# EAGLE design XStick._XS1-L4 (EAGLE 7.1.0)
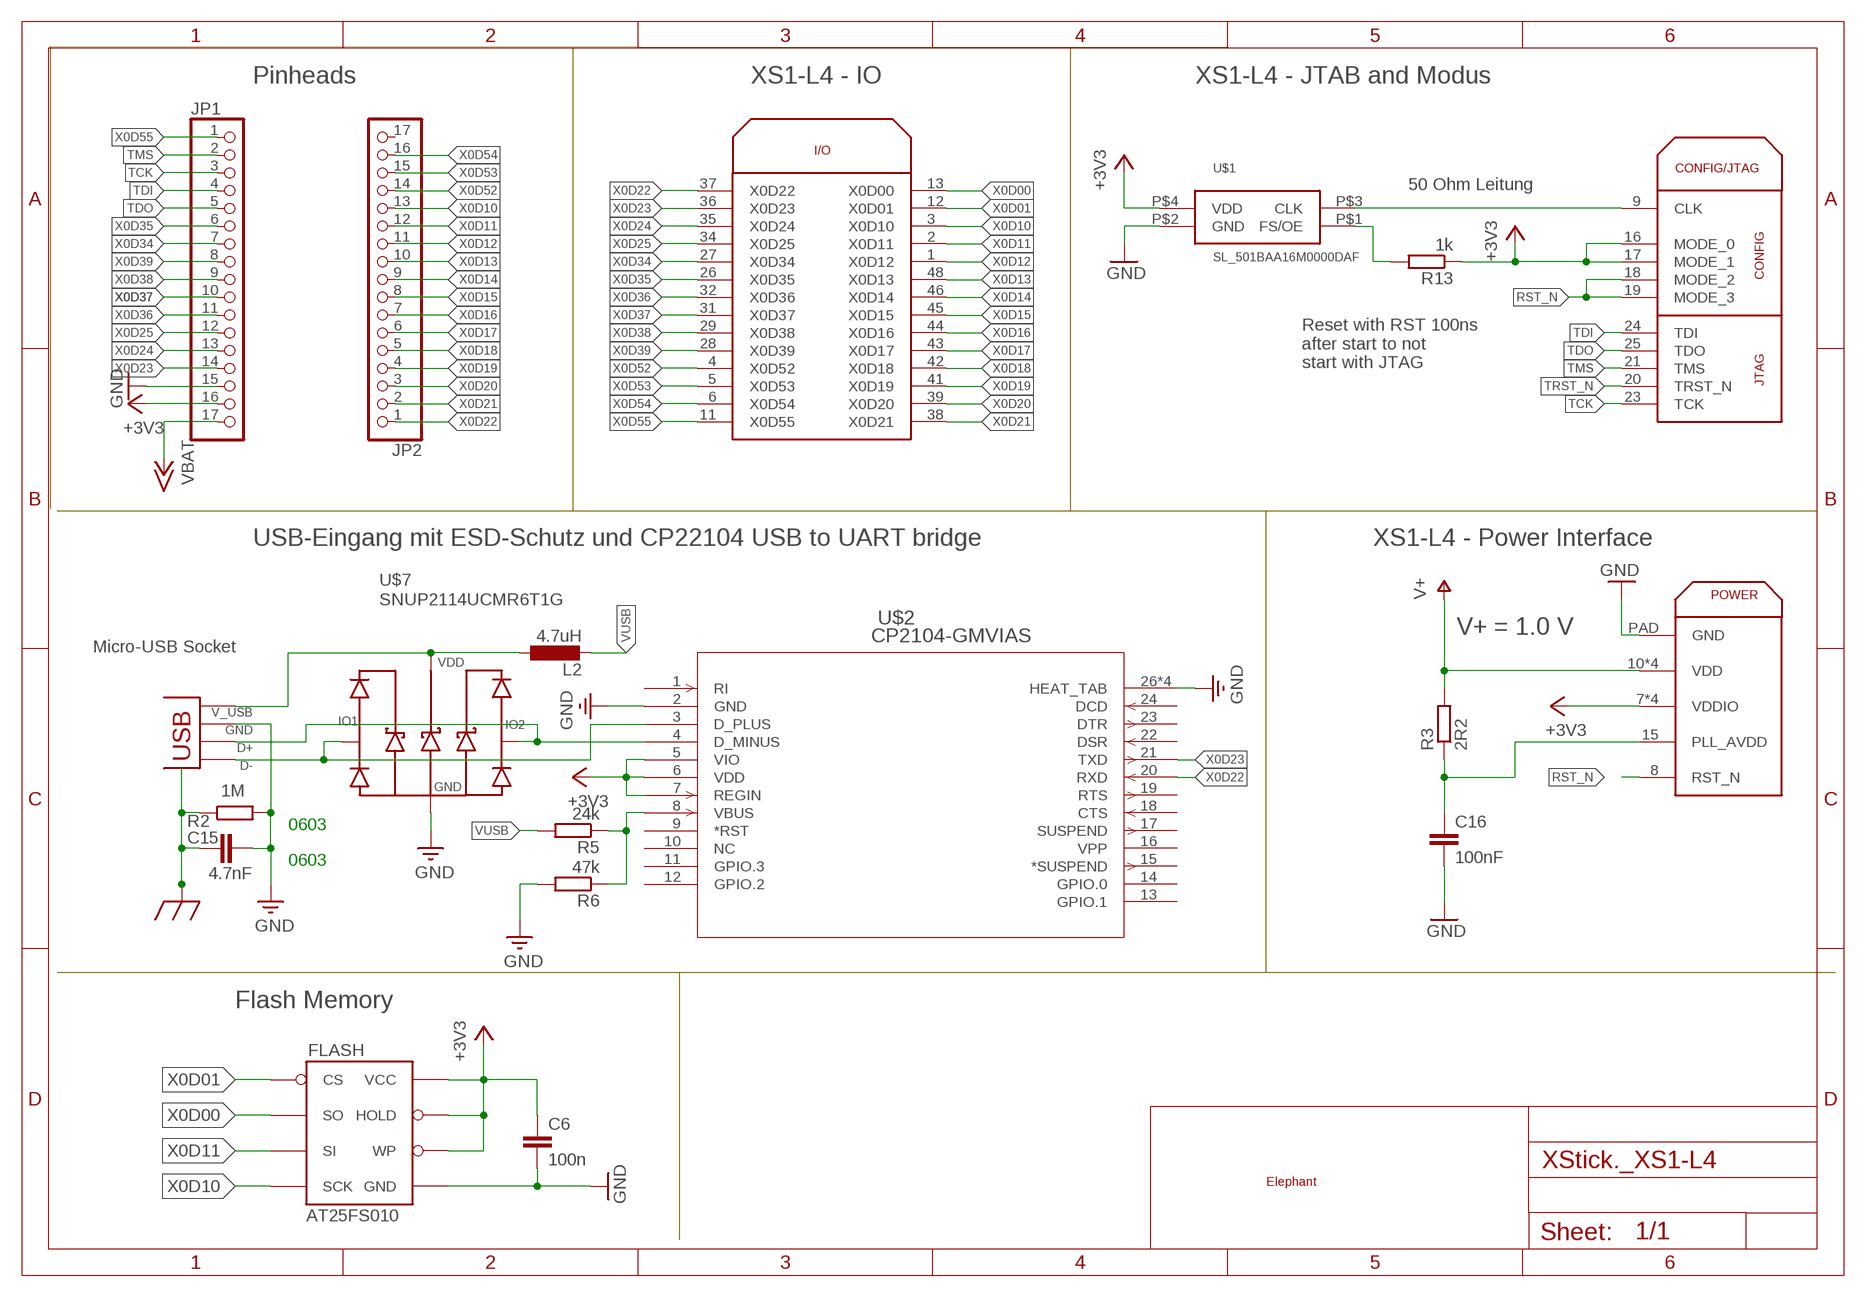
[diagram p0: schematic, sheet 1, part 1 of 2]
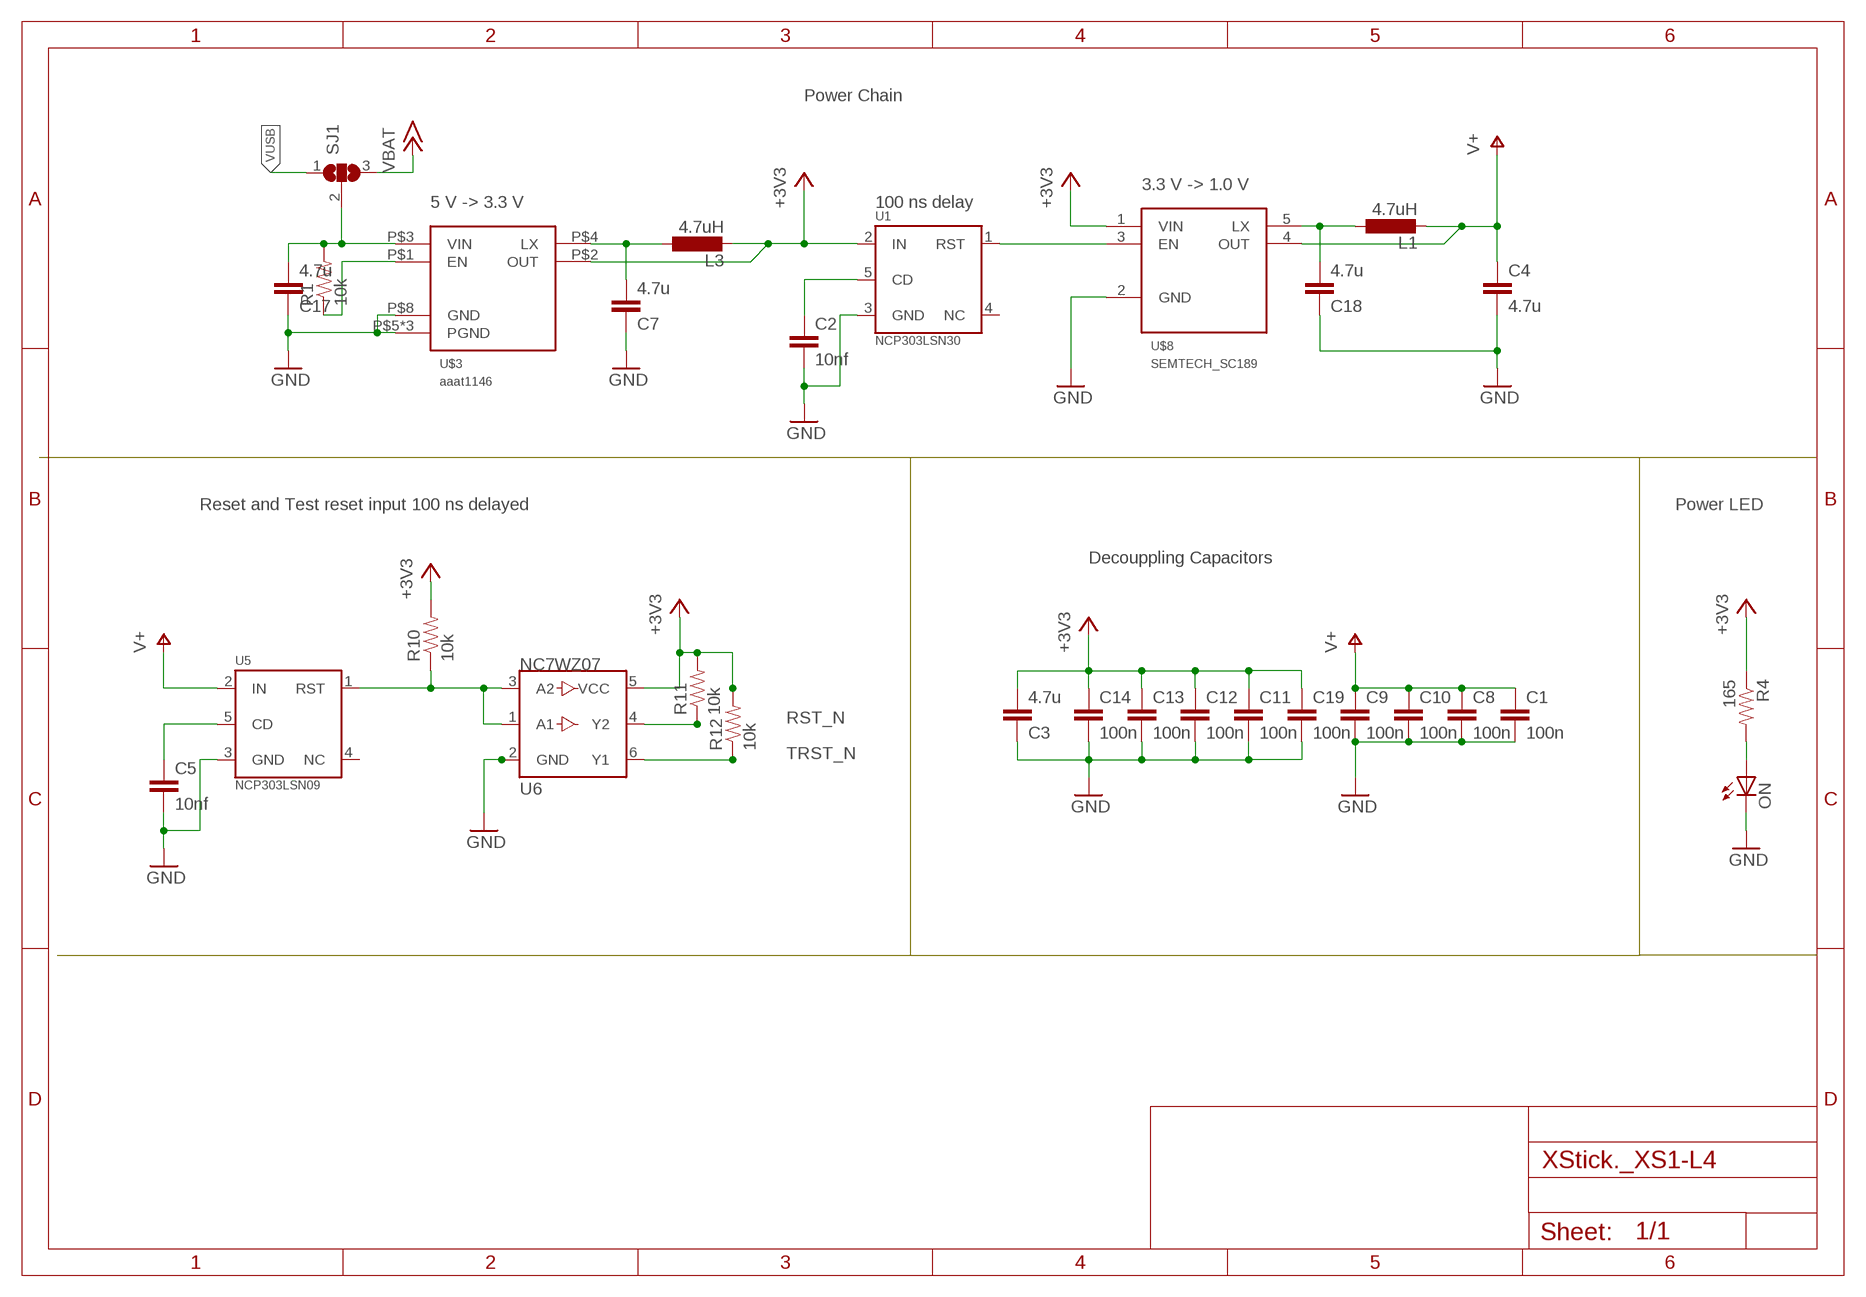
[diagram p1: schematic, sheet 1, part 2 of 2]

## Parts
C1  100n  C-EUC0402  [C0402]
C2  10nf  CAP0603-CAP  [0603-CAP]
C3  4.7u  CAP0603-CAP  [0603-CAP]
C4  4.7u  CAP0603-CAP  [0603-CAP]
C5  10nf  CAP0603-CAP  [0603-CAP]
C6  100n  C-EUC0402  [C0402]
C7  4.7u  CAP0603-CAP  [0603-CAP]
C8  100n  C-EUC0402  [C0402]
C9  100n  C-EUC0402  [C0402]
C10  100n  C-EUC0402  [C0402]
C11  100n  C-EUC0402  [C0402]
C12  100n  C-EUC0402  [C0402]
C13  100n  C-EUC0402  [C0402]
C14  100n  C-EUC0402  [C0402]
C15  4.7nF  C_EU0603MARK  [C0603M]
C16  100nF  C-EUC0402  [C0402]
C17  4.7u  CAP0603-CAP  [0603-CAP]
C18  4.7u  CAP0603-CAP  [0603-CAP]
C19  100n  C-EUC0402  [C0402]
FLASH  AT25FS010  [SO08WIDE]
JP1  PINHD-1X17  [1X17]
JP2  PINHD-1X17  [1X17]
L1  4.7uH  L-EUL0603  [C0603]
L2  4.7uH  L-EUL0603  [C0603]
L3  4.7uH  L-EUL0603  [C0603]
ON  LED0603  [LED-0603]
R1  10k  RESISTOR0603-RES  [0603-RES]
R2  1M  RESISTOR0603MARK  [R0603M]
R3  2R2  R-EU_R0603  [R0603]
R4  165  RESISTOR0603-RES  [0603-RES]
R5  24k  R-EU_R0603  [R0603]
R6  47k  R-EU_R0603  [R0603]
R10  10k  RESISTOR0603-RES  [0603-RES]
R11  10k  RESISTOR0603-RES  [0603-RES]
R12  10k  RESISTOR0603-RES  [0603-RES]
R13  1k  R-EU_R0603  [R0603]
SJ1  SJ2W  [SJ_2]
U1  NCP303LSN30  NCP303LSN09  [SOT23-5]
U5  NCP303LSN09  [SOT23-5]
U6  NC7WZ07  [SC70-6]
U$1  SL_501BAA16M0000DAF  [SL_OSZ]
U$2  CP2104-GMVIAS  [QFN24_4X4_VIAS]
U$3  aaat1146  SKYWORKS_AAT1146_SC70JW-8  [SC70JW-8]
U$4  ELEPHANT  [ELEPHANT]
U$5  XS1-L01A-TQ48  [TQFP48]
U$7  SNUP2114UCMR6T1G  [TSOP-6]
U$8  SEMTECH_SC189  [SOT23-5]
USB_SKT  USB_SHIELD_8  [USB_MICRO_B]

## Nets
+3V3 [Power]: C3.2 C6.1 C11.1 C12.1 C13.1 C14.1 C19.1 FLASH.3(WP) FLASH.7(HOLD) FLASH.8(VCC) JP1.16 L3.2 R4.1 R10.2 R11.2 R12.2 R13.1 U1.2(IN) U6.5(VCC) U$1.P$4(VDD) U$2.5(VIO) U$2.6(VDD) U$2.7(REGIN) U$3.P$2(OUT) U$5.7(VDDIO) U$5.14(VDDIO) U$5.16(MODE_0) U$5.17(MODE_1) U$5.30(VDDIO) U$5.40(VDDIO) U$8.1(VIN)
+15V: JP1.17 SJ1.3 ; supply symbol labelled VBAT
D+: U$2.4(D_MINUS) U$7.1(I/O1) USB_SKT.D+
D-: U$2.3(D_PLUS) U$7.6(I/O2) USB_SKT.D-
GND: C1.2 C2.2 C3.1 C4.2 C5.2 C6.2 C7.1 C8.2 C9.2 C10.2 C11.2 C12.2 C13.2 C14.2 C15.1 C16.2 C17.1 C18.1 C19.2 FLASH.4(GND) JP1.15 ON.C R2.2 R6.2 U1.3(GND) U5.3(GND) U6.2(GND) U$1.P$2(GND) U$2.2(GND) U$2.26(HEAT_TAB) U$2.27(HEAT_TAB) U$2.28(HEAT_TAB) U$2.29(HEAT_TAB) U$3.P$5(PGND) U$3.P$6(PGND) U$3.P$7(PGND) U$3.P$8(GND) U$5.PAD(GND) U$7.2(VN) U$8.2(GND) USB_SKT.GND
N$1: U$1.P$3(CLK) U$5.9(CLK)
N$3: C7.2 L3.1 U$3.P$4(LX)
N$4: R10.1 U5.1(RST) U6.1(A1) U6.3(A2)
N$5: ON.A R4.2
N$6: C5.1 U5.5(CD)
N$7: U1.1(RST) U$8.3(EN)
N$8: C18.2 L1.1 U$8.5(LX)
N$9: L2.1 U$7.5(VP) USB_SKT.VBUS(V_USB)
N$10: C2.1 U1.5(CD)
N$11: C17.2 R1.2 SJ1.2 U$3.P$3(VIN)
N$12 [Power]: R13.2 U$1.P$1(FS/OE)
N$14: R1.1 U$3.P$1(EN)
N$15: R5.1 R6.1 U$2.8(VBUS)
N$50: C16.1 R3.1 U$5.15(PLL_AVDD)
RST_N: R11.1 U6.4(Y2) U$5.8(RST_N) U$5.18(MODE_2) U$5.19(MODE_3)
TCK: JP1.3 U$5.23(TCK)
TDI: JP1.4 U$5.24(TDI)
TDO: JP1.5 U$5.25(TDO)
TMS: JP1.2 U$5.21(TMS)
TRST_N: R12.1 U6.6(Y1) U$5.20(TRST_N)
USB_SHIELD: C15.2 R2.1 USB_SKT.SHIELD$1 USB_SKT.SHIELD$2(SHIELD$1) USB_SKT.SHIELD$3(SHIELD$1) USB_SKT.SHIELD$4(SHIELD$1) USB_SKT.SHIELD$5(SHIELD$1) USB_SKT.SHIELD$6(SHIELD$1) USB_SKT.SHIELD$7(SHIELD$1) USB_SKT.SHIELD$8(SHIELD$1)
V+: C1.1 C4.1 C8.1 C9.1 C10.1 L1.2 R3.2 U5.2(IN) U$5.10(VDD) U$5.22(VDD) U$5.33(VDD) U$5.47(VDD) U$8.4(OUT)
VUSB: L2.2 R5.2 SJ1.1
X0D00 [Wire out]: FLASH.2(SO) U$5.13(X0D00)
X0D01 [Wire out]: FLASH.1(CS) U$5.12(X0D01)
X0D10: FLASH.6(SCK) JP2.13 U$5.3(X0D10)
X0D11: FLASH.5(SI) JP2.12 U$5.2(X0D11)
X0D12: JP2.11 U$5.1(X0D12)
X0D13: JP2.10 U$5.48(X0D13)
X0D14: JP2.9 U$5.46(X0D14)
X0D15: JP2.8 U$5.45(X0D15)
X0D16: JP2.7 U$5.44(X0D16)
X0D17: JP2.6 U$5.43(X0D17)
X0D18: JP2.5 U$5.42(X0D18)
X0D19: JP2.4 U$5.41(X0D19)
X0D20: JP2.3 U$5.39(X0D20)
X0D21: JP2.2 U$5.38(X0D21)
X0D22: JP2.1 U$2.20(RXD) U$5.37(X0D22)
X0D23: JP1.14 U$2.21(TXD) U$5.36(X0D23)
X0D24: JP1.13 U$5.35(X0D24)
X0D25: JP1.12 U$5.34(X0D25)
X0D34: JP1.7 U$5.27(X0D34)
X0D35: JP1.6 U$5.26(X0D35)
X0D36: JP1.11 U$5.32(X0D36)
X0D37: JP1.10 U$5.31(X0D37)
X0D38: JP1.9 U$5.29(X0D38)
X0D39: JP1.8 U$5.28(X0D39)
X0D52: JP2.14 U$5.4(X0D52)
X0D53: JP2.15 U$5.5(X0D53)
X0D54: JP2.16 U$5.6(X0D54)
X0D55: JP1.1 U$5.11(X0D55)
Unconnected: JP2.17 U1.4(NC) U5.4(NC) U$2.1(RI) U$2.9(*RST) U$2.10(NC) U$2.11(GPIO.3) U$2.12(GPIO.2) U$2.13(GPIO.1) U$2.14(GPIO.0) U$2.15(*SUSPEND) U$2.16(VPP) U$2.17(SUSPEND) U$2.18(CTS) U$2.19(RTS) U$2.22(DSR) U$2.23(DTR) U$2.24(DCD)

## Notes on the sheet
- Pinheads | XS1-L4 - IO | XS1-L4 - JTAB and Modus
- Power Chain
- 50 Ohm Leitung | 3.3 V -> 1.0 V
- 5 V -> 3.3 V | 100 ns delay
- Reset with RST 100ns 
  after start to not 
  start with JTAG
- Reset and Test reset input 100 ns delayed | Power LED
- USB-Eingang mit ESD-Schutz und CP22104 USB to UART bridge | XS1-L4 - Power Interface
- Decouppling Capacitors
- V+ = 1.0 V
- Micro-USB Socket
- 0603
- 0603
- Flash Memory

## Library data of the parts
C1 C6 C8-C14 C16 C19 = rcl:C-EU: CAPACITOR, European symbol
C2-C5 C7 C17 C18 = SparkFun:CAP: Capacitor Standard 0603 ceramic capacitor, and 0.1" leaded capacitor.
C15 = Batten:C_EU
FLASH = SparkFun:AT25FS010
JP1 JP2 = pinhead_original:PINHD-1X17: PIN HEADER
L1-L3 = rcl:L-EU: INDUCTOR, European symbol
ON = SparkFun:LED: LEDs Standard schematic elements and footprints for 5mm, 3mm, 1206, and 0603 sized LEDs. 5mm - Spark Fun Electronics SKU : COM-00529 (and others)
R1 R4 R10-R12 = SparkFun:RESISTOR: Resistor Basic schematic elements and footprints for 0603, 1206, and PTH 1/10th watt (small) resistors.
R2 = Batten:RESISTOR
R3 R5 R6 R13 = resistor:R-EU_: RESISTOR, European symbol
SJ1 = jumper:SJ2W: SMD solder JUMPER
U1 U5 = SparkFun:NCP303LSN09
U6 = SparkFun:NC7WZ07
U$1 = Carlos2014:SL_501BAA16M0000
U$2 = Carlos2014:CP2104-GM
U$3 = Carlos2014:SKYWORKS_AAT1146
U$4 = Carlos2014:ELEPHANT
U$5 = XMOS:XS1-L01A-TQ48
U$7 = Carlos2014:SNUP2114
U$8 = Carlos2014:SEMTECH_SC189
USB_SKT = Batten:USB_SHIELD_8

## Board
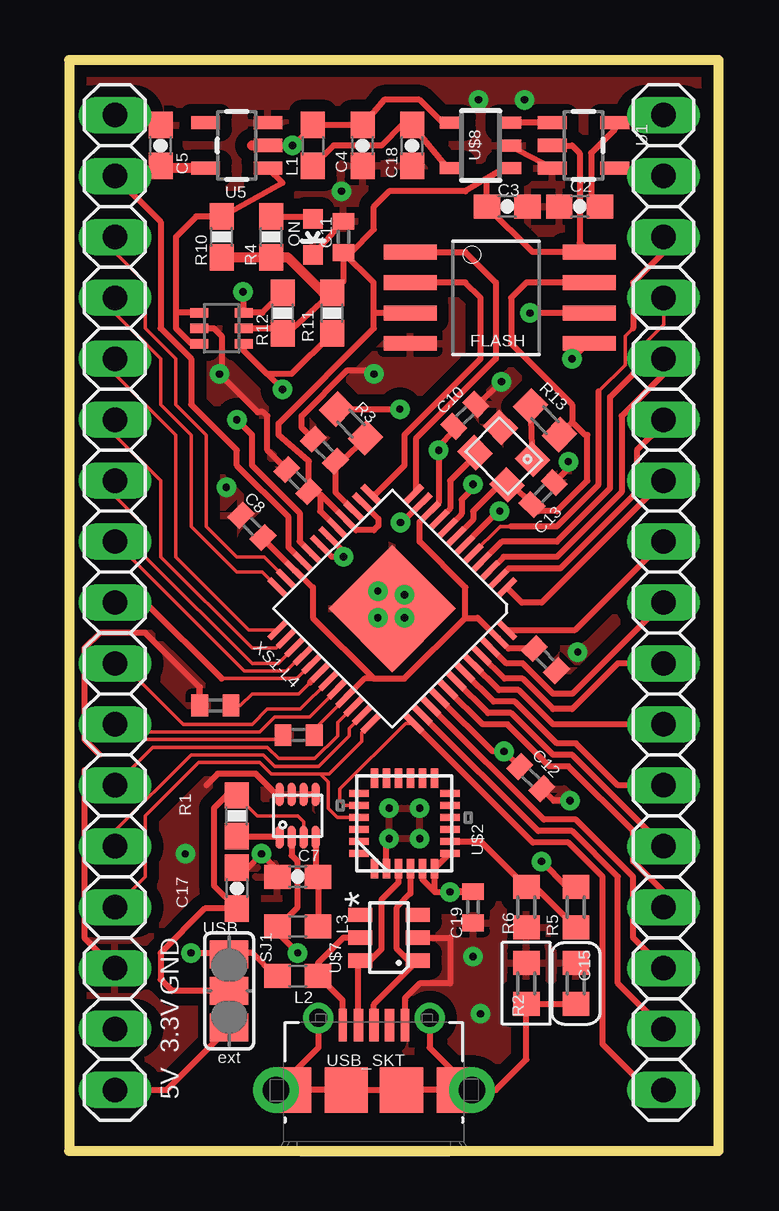
[diagram p2: board, top side]
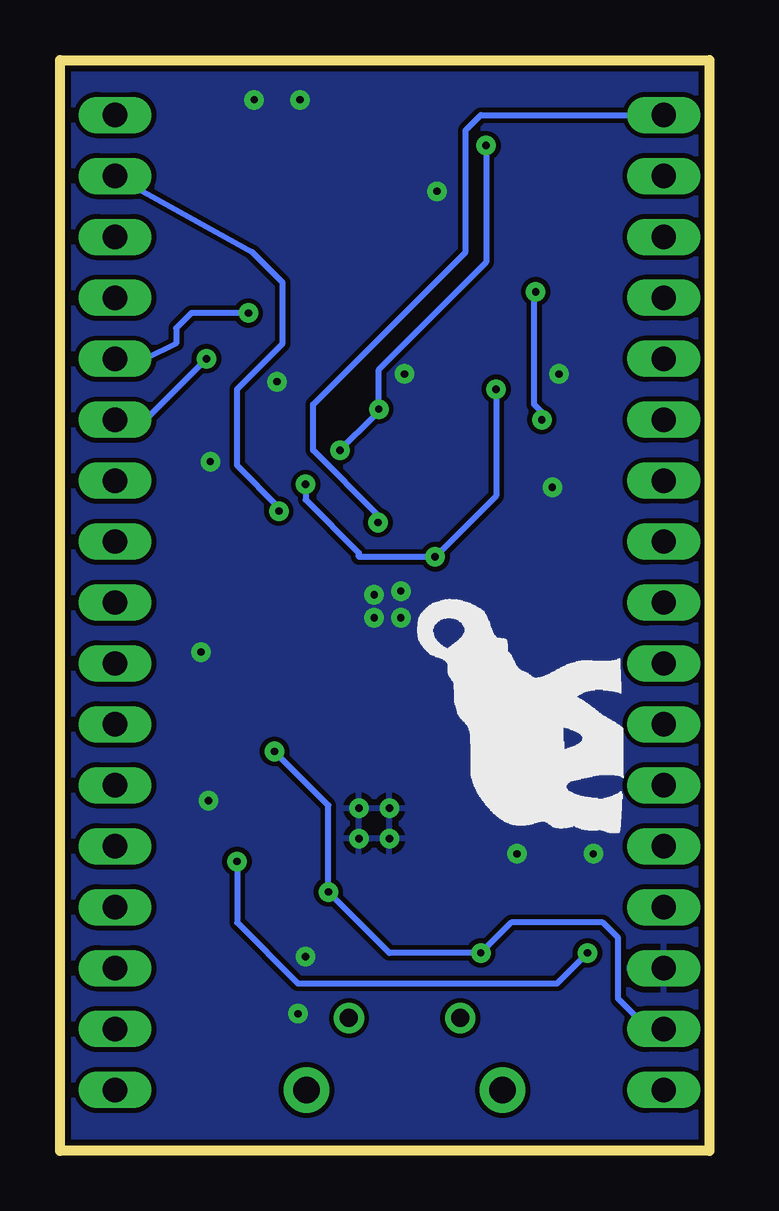
[diagram p3: board, bottom side, seen from below]

Size 27.06 x 45.48 mm. Coordinates in mm from the lower left corner, seen from the top.
Outline: 0,0 27.06,0 27.06,45.48 0,45.48 0,0
Copper layers (1*16): Top 0.035mm / dielectric 1.5mm / Bottom 0.035mm
Design rules "SeeedStudio_2layer_DRU_CM": minimum track width 6mil, minimum drill 12mil, track to track 6mil, track to pad 6mil, pad to pad 6mil, via to via 6mil, smd to smd 0mil, copper to edge 10mil, drill to drill 10mil, minimum pad ring 10mil, minimum via ring 6mil, stop-mask expansion 2mil, vias tented up to drill 100mil, thermal gap 10mil

### Footprints (pad centres in the part's own frame; a part is rotated, then mirrored left to right if it is on the bottom)
C0402 = smd 0.7 x 0.9: 1 -0.65,0; 2 0.65,0
0603-CAP = smd 1.1 x 1: 1 -0.85,0; 2 0.85,0
C0603M = smd 1 x 1.1: 1 -0.85,0; 2 0.85,0
SO08WIDE = smd 0.61 x 2.21: 1 -1.905,-3.569; 2 -0.635,-3.569; 3 0.635,-3.569; 4 1.905,-3.569; 5 1.905,3.886; 6 0.635,3.886; 7 -0.635,3.886; 8 -1.905,3.886
1X17 = drill 1.016 long: 1 -20.32,0; 2 -17.78,0; 3 -15.24,0; 4 -12.7,0; 5 -10.16,0; 6 -7.62,0; 7 -5.08,0; 8 -2.54,0; 9 0,0; 10 2.54,0; 11 5.08,0; 12 7.62,0; 13 10.16,0; 14 12.7,0; 15 15.24,0; 16 17.78,0; 17 20.32,0
C0603 = smd 1.1 x 1: 1 -0.85,0; 2 0.85,0
LED-0603 = smd 0.8 x 0.8: A 0,-0.75; C 0,0.75
0603-RES = smd 1.1 x 1: 1 -0.85,0; 2 0.85,0
R0603M = smd 1 x 1.1: 1 -0.85,0; 2 0.85,0
R0603 = smd 1 x 1.1: 1 -0.85,0; 2 0.85,0
SJ_2 = smd 1.168 x 1.6: 1 -1.524,0; 2 0,0; 3 1.524,0
SOT23-5 = smd 0.55 x 1.2: 1 -0.95,-1.3; 2 0,-1.3; 3 0.95,-1.3; 4 0.95,1.3; 5 -0.95,1.3
SC70-6 = smd 0.4 x 0.75: 1 -0.65,-0.925; 2 0,-0.925; 3 0.65,-0.925; 4 0.65,0.925; 5 0,0.925; 6 -0.65,0.925
SL_OSZ = smd 1.1 x 1: P$1 -0.95,-0.75; P$2 0.95,-0.75; P$3 0.95,0.75; P$4 -0.95,0.75
QFN24_4X4_VIAS = smd 0.813 x 0.305: 1 -1.892,1.25; 2 -1.892,0.75; 3 -1.892,0.25; 4 -1.892,-0.25; 5 -1.892,-0.75; 6 -1.892,-1.25; 13 1.892,-1.25; 14 1.892,-0.75; 15 1.892,-0.25; 16 1.892,0.25; 17 1.892,0.75; 18 1.892,1.25 | smd 0.305 x 0.813: 7 -1.25,-1.892; 8 -0.75,-1.892; 9 -0.25,-1.892; 10 0.25,-1.892; 11 0.75,-1.892; 12 1.25,-1.892; 19 1.25,1.892; 20 0.75,1.892; 21 0.25,1.892; 22 -0.25,1.892; 23 -0.75,1.892; 24 -1.25,1.892 | drill 0.305 pad 0.813: 26 -0.635,-0.635; 27 0.635,0.635; 28 -0.635,0.635; 29 0.635,-0.635
SC70JW-8 = smd 0.965 x 0.33: P$1 -0.889,0.75; P$2 -0.889,0.25; P$3 -0.889,-0.25; P$4 -0.889,-0.75; P$5 0.889,-0.75; P$6 0.889,-0.25; P$7 0.889,0.25; P$8 0.889,0.75
TQFP48 = smd 1 x 0.25: 1 -3.93,2.905; 2 -3.93,2.405; 3 -3.93,1.905; 4 -3.93,1.405; 5 -3.93,0.905; 6 -3.93,0.405; 7 -3.93,-0.095; 8 -3.93,-0.595; 9 -3.93,-1.095; 10 -3.93,-1.595; 11 -3.93,-2.095; 12 -3.93,-2.595; 25 4.07,-2.595; 26 4.07,-2.095; 27 4.07,-1.595; 28 4.07,-1.095; 29 4.07,-0.595; 30 4.07,-0.095; 31 4.07,0.405; 32 4.07,0.905; 33 4.07,1.405; 34 4.07,1.905; 35 4.07,2.405; 36 4.07,2.905 | smd 0.25 x 1: 13 -2.68,-3.845; 14 -2.18,-3.845; 15 -1.68,-3.845; 16 -1.18,-3.845; 17 -0.68,-3.845; 18 -0.18,-3.845; 19 0.32,-3.845; 20 0.82,-3.845; 21 1.32,-3.845; 22 1.82,-3.845; 23 2.32,-3.845; 24 2.82,-3.845; 37 2.82,4.155; 38 2.32,4.155; 39 1.82,4.155; 40 1.32,4.155; 41 0.82,4.155; 42 0.32,4.155; 43 -0.18,4.155; 44 -0.68,4.155; 45 -1.18,4.155; 46 -1.68,4.155; 47 -2.18,4.155; 48 -2.68,4.155 | smd 3.75 x 3.75: PAD 0.07,0.155
TSOP-6 = smd 0.6 x 1: 1 -0.95,-1.2; 2 0,-1.2; 3 0.95,-1.2; 4 0.95,1.2; 5 0,1.2; 6 -0.95,1.2
SOT23-5' = smd 0.5 x 1: 1 -0.95,-1.2; 2 0,-1.2; 3 0.95,-1.2; 4 0.95,1.2; 5 -0.95,1.2
USB_MICRO_B = smd 0.4 x 1.35: D+ 0,-2.7; D- 0.65,-2.7; ID -0.65,-2.7 | smd 0.35 x 1.35: GND -1.3,-2.7; VBUS 1.3,-2.7 | drill 1.1 pad 1.9: SHIELD$1 -4.085,0; SHIELD$2 4.085,0 | drill 0.75 pad 1.15: SHIELD$3 -2.32,-3; SHIELD$4 2.32,-3 | smd 1.47 x 1.9: SHIELD$5 -3.35,0; SHIELD$8 3.35,0 | smd 1.8 x 1.9: SHIELD$6 -1.15,0; SHIELD$7 1.15,0

### Placement (x,y rotation side)
C1  19.84,20.48 315 top
C2  21.27,39.37 180 top
C3  18.26,39.37 180 top
C4  12.22,41.91 270 top
C5  3.81,41.91 90 top
C6  9.53,27.94 135 top
C7  9.53,11.43 0 top
C8  7.62,26.04 135 top
C9  9.56,17.34 180 top
C10  16.49,30.66 45 top
C11  11.43,38.1 90 top
C12  19.24,15.56 315 top
C13  19.75,27.4 45 top
C14  6.09,18.57 180 top
C15  21.11,6.99 270 top
C16  10.64,29.21 135 top
C17  6.99,10.95 270 top
C18  14.29,41.91 90 top
C19  16.83,10.16 270 top
FLASH  17.78,35.56 270 top
JP1  1.91,22.86 270 top
JP2  24.77,22.86 90 top
L1  10.16,41.91 90 top
L2  9.53,7.3 180 top
L3  9.53,9.37 180 top
ON  10.16,38.1 180 top
R1  6.99,13.97 90 top
R2  19.05,6.99 90 top
R3  11.75,30.32 135 top
R4  8.41,38.1 90 top
R5  21.11,10.16 90 top
R6  19.05,10.16 270 top
R10  6.35,38.1 270 top
R11  10.95,34.92 90 top
R12  8.89,34.92 270 top
R13  19.83,30.46 135 top
SJ1  6.67,6.67 270 top
U1  21.43,41.91 270 top
U5  6.99,41.91 90 top
U6  6.35,34.29 270 top
U$1  18.11,28.97 135 top
U$2  13.97,13.65 90 top
U$3  9.53,13.97 90 top
U$4  3.81,13.34 90 bottom
U$5  13.4,22.76 225 top
U$7  13.34,8.89 90 top
U$8  SEMTECH_SC189  [SOT23-5']  17.14,41.91 90 top
USB_SKT  12.7,2.54 180 top

### Tracks (layer width: path | path; a pad name or v marks a point on that pad's centre or on a via)
+3V3  (via drill 0.3 pad 0.81)
  Top 0.152: C14.1 7.14,18.57 7.62,19.05 9.56,19.05 U$5.30
  Top 0.254: U$2.7 U$2.6 15.22,10.81 | FLASH.3 12.69,34.92 | U$8.1 18.1,40.96 17.72,40.73 | 17.72,40.73 16.51,40.01 13.34,40.01 12.7,39.37 12.7,38.42 11.73,37.45 C11.1 | U$5.7 16.83,26.32 16.83,26.67 17.92,27.77 U$1.P$4 18.46,27.77 C13.1 19.56,26.67 20.32,26.67 21.59,27.94 21.59,29.84 21.5,29.84 20.95,30.39 | U$5.17 10.46,26.67 10.46,27.37 | 20.43,29.74 R13.1 20.95,30.39 | U6.5 8.68,34.29 R12.2 9.1,34.08 R11.2 11.43,36.25 C11.1 | 16.17,10.81 C19.1 16.81,10.79 v15.88,10.79 15.24,10.79 15.22,10.81 | U$2.5 14.72,11.31 15.22,10.81 | U$3.P$2 9.28,12.31 9.53,12.06 9.53,10.16 8.73,9.37 L3.2 8.68,9.11 v9.53,8.26 | C12.1 v18.12,16.65 17.65,16.65 U$5.40 | 10.46,27.37 U$5.16 11.96,25.88 12.7,25.88 12.89,26.06 12.89,26.36 U$5.14 | 10.04,19.53 U$5.30 | U1.2 20.95,41.91 21.27,41.59 21.27,37.86 FLASH.8 19.31,37.47 C3.2 17.41,40.42 17.72,40.73 | 10.46,27.37 10.16,27.37 | 10.16,27.37 10.09,27.37 | 12.69,34.92 12.7,34.91 12.7,34.29 8.73,30.32 8.73,29.84 9.98,28.75 C6.1 10.05,27.48 10.16,27.37 | FLASH.7 19.05,36.2 18.41,35.56 18.41,33.66 20.95,31.11 20.95,30.39 | 12.69,34.92 12.69,36.2 C11.1
  Top 0.406: R10.2 R4.1 9.11,37.25 10.58,35.77 R11.2
  Bottom 0.254: JP1.16 2.54,5.08 3.81,6.35 3.81,8.89 4.45,9.53 8.26,9.53 v9.53,8.26 13.34,8.26 v15.88,10.79 15.88,14.4 v18.12,16.65
+15V
  Top 0.254: JP1.17 4.06,2.54 SJ1.3
D+
  Top 0.254: USB_SKT.D+ 12.7,6.11 U$7.1 14.13,7.94 13.65,8.41 13.65,10.16 14.22,10.73 U$2.4
D-
  Top 0.254: USB_SKT.D- 12.05,7.86 U$7.6 12.54,7.94 13.02,8.41 13.02,10.48 13.72,11.18 U$2.3
GND  (via drill 0.3 pad 0.81)
  Top 0.152: 0.64,15.88 1.27,16.51 2.54,16.51 3.17,17.14 8.71,17.14 C9.2
  Top 0.254: C7.1 8.68,11.72 v8.01,12.38 7.43,11.8 C17.1 | U$3.P$8 8.64,14.86 7.78,15.72 6.19,15.72 5.71,15.24 | v20.87,14.61 20.19,14.61 C12.2 | U$2.2 13.22,12.9 U$2.28 | 0.64,15.88 0.64,8.89 JP1.15 | U1.3 U$8.2 | ON.C C11.2 | U6.2 6.03,34.29 6.35,33.97 6.35,32.38 | C14.2 5.44,19.32 3.17,21.59 1.27,21.59 0.64,20.95 0.64,17.14 1.27,16.51 | C16.2 | C16.2 9.68,30.16 9.68,30.64 11.59,32.54 12.54,32.54 v12.7,32.38 | C6.2 | C6.2 8.26,29.21 8.26,30.64 8.1,30.8 7.86,30.8 v6.27,32.38 | USB_SKT.GND 14,6.38 14.61,6.99 15.88,6.99 15.88,8.89 U$7.2 | U$3.P$5 U$3.P$6 | C10.2 17.07,31.12 v18.02,32.07 | 20.21,28.05 C13.2 20.8,28.45 v20.8,28.73 | 20.21,28.14 20.21,28.05 | 20.21,28.05 20.32,27.94
  other vias: 4.84,12.38 21.19,20.8 11.35,40.01 6.55,27.66 12.86,22.23 13.97,23.18 13.97,22.23 12.86,23.34 17.14,5.71 16.83,8.1 17.06,43.81 18.97,43.81
  pour Bottom (isolate 0.2): 27.02,-0.04 0,0 0.14,45.55 27.16,45.52
  pour Top (isolate 0.5): 26.67,0 0,0 0,45.72 27.3,45.48
N$1
  Top 0.254: U$1.P$3 16.91,28.97 15.88,27.94 15.88,26.78 U$5.9
N$3
  Top 0.254: U$3.P$4 10.28,11.53 C7.2 L3.1
N$4
  Top 0.254: U5.1 8.89,40.35 R10.1 5.29,38.95 4.45,38.1 4.45,34.92 | 4.45,34.92 4.45,34.29 5.08,33.66 5.41,33.66 U6.3 | U6.1 4.46,34.94 4.45,34.92
N$5
  Top 0.254: R4.2 10.06,38.95 ON.A
N$6
  Top 0.406: U5.5 3.91,40.96 C5.1
N$7
  Top 0.254: U1.1 U$8.3
N$8
  Top 0.254: U$8.5 15.77,40.96 C18.2 13.87,42.76 13.02,41.91 11.01,41.91 L1.1
N$9
  Top 0.254: USB_SKT.VBUS 11.4,6.28 L2.1 10.38,7.83 11.43,8.89 U$7.5
N$10
  Top 0.254: U1.5 22.73,42.58 21.75,41.59 21.75,39.74 C2.1
N$11
  Top 0.152: U$3.P$3 9.78,13.72 9.53,13.97 7.83,13.97 R1.2
  Top 0.254: SJ1.2 4.29,6.67 3.81,7.14 3.81,8.26 5.66,10.1 C17.2 6.03,11.06 6.03,14.29 6.57,14.82 R1.2
N$12
  Top 0.254: U$1.P$1 R13.2
N$14
  Top 0.254: U$3.P$1 7.02,13.08 R1.1
N$15
  Top 0.254: U$2.8 17.16,12.9 R6.1 19.41,11.01 R5.1
N$50
  Top 0.254: U$5.15 11.1,27.45 C16.1 11.38,28.75 R3.1
RST_N  (via drill 0.3 pad 0.81)
  Top 0.254: v16.83,27.78 16.83,27.62 16.35,27.15 16.35,26.55 U$5.8 | U6.4 7.28,33.37 8.26,32.38 | R11.1 9.26,32.38 8.26,32.38 | U$5.18 11.43,24.99 v11.43,24.77 10.95,24.77 U$5.19 | 8.26,32.38 v8.89,31.75
  Bottom 0.254: v8.89,31.75 8.89,27.3 v11.43,24.77 14.61,24.77 14.61,24.92 16.83,27.15 v16.83,27.78
TCK
  Top 0.152: JP1.3 1.91,37.47 3.17,36.2 3.17,34.29 4.45,33.02 4.45,31.11 5.71,29.84 5.71,26.04 6.99,24.77 8.12,24.77 U$5.23
TDI
  Top 0.152: JP1.4 1.91,34.92 3.81,33.02 3.81,31.11 5.08,29.84 5.08,26.04 6.99,24.13 8.05,24.13 U$5.24
TDO
  Top 0.152: U$5.25 7.49,21.72 4.45,24.77 4.45,29.84 1.91,32.38 JP1.5
TMS
  Top 0.254: JP1.2 3.81,38.73 3.81,34.29 5.08,33.02 5.08,31.11 6.99,29.21 6.99,28.57 9.14,26.42 9.14,25.16 U$5.21
TRST_N  (via drill 0.3 pad 0.81)
  Top 0.254: R12.1 8.05,34.94 U6.6 7.28,35.78 v7.24,35.81 | U$5.20 9.6,25.4 9.6,26.59 7.62,28.57 7.62,29.84 v6.99,30.48
  Bottom 0.254: 7.37,35.81 v7.24,35.81 7.3,35.75 7.3,31.11 6.99,30.8 v6.99,30.48
USB_SHIELD
  Top 0.254: USB_SKT.SHIELD$4 10.38,4.3 USB_SKT.SHIELD$2 USB_SKT.SHIELD$8 USB_SKT.SHIELD$7 USB_SKT.SHIELD$6 USB_SKT.SHIELD$5 USB_SKT.SHIELD$1 | USB_SKT.SHIELD$3 15.02,4.3 USB_SKT.SHIELD$1 | USB_SKT.SHIELD$1 17.78,2.54 19.05,3.81 R2.1 C15.2
V+  (via drill 0.3 pad 0.81)
  Top 0.152: C9.1 10.21,17.58 U$5.33
  Top 0.254: U$8.4 15.56,42.86 14.61,43.81 13.12,43.81 C4.1 L1.2 v9.31,41.91 U5.2 | C1.1 18.31,20.94 U$5.47 17.02,22.23 16.51,22.23 | C10.1 16.03,30 15.4,29.37 v15.4,29.21 15.4,27.01 U$5.10 14.61,26.22 14.61,25.4 16.51,23.5 16.51,22.23 | C8.1 8.08,25.51 U$5.22 9.46,24.19 10.16,23.5 10.16,22.23 12.7,19.68 | 11.81,19.18 U$5.33 12.31,19.68 12.7,19.68 | 12.7,19.68 13.97,19.68 16.51,22.23 | R3.2 v13.78,30.92
  Top 0.406: U5.2 7.62,41.91
  Bottom 0.254: v9.31,41.91 9.31,37.05 13.78,32.58 v13.78,30.92 13.97,30.73 13.97,30.64 v15.4,29.21
VUSB  (via drill 0.3 pad 0.81)
  Top 0.254: L2.2 8.57,7.3 7.62,8.26 6.73,8.26 SJ1.1 6.6,8.26 v5.08,8.26 | R5.2 20.74,11.01 v19.68,12.06
  Bottom 0.254: v19.68,12.06 19.68,9.53 17.14,6.99 6.35,6.99 v5.08,8.26
X0D00
  Top 0.254: U$5.13 12.77,27.38 13.65,28.26 13.97,28.57 13.97,29.84 17.14,33.02 17.14,35.56 16.51,36.2 FLASH.2
X0D01
  Top 0.254: FLASH.1 16.51,37.47 17.78,36.2 17.78,33.02 14.45,29.69 14.45,27.47 U$5.12 14.61,27.63
X0D10  (via drill 0.3 pad 0.81)
  Top 0.254: JP2.13 24.77,32.38 23.02,30.64 23.02,27.46 20.32,24.77 18.1,24.77 U$5.3 | FLASH.6 v19.21,34.92
  Bottom 0.254: v19.21,34.92 21.59,34.92 22.23,34.29 22.23,33.66 23.5,33.02 JP2.13 24.13,33.02
X0D11  (via drill 0.3 pad 0.81)
  Top 0.254: U$5.2 18.33,24.29 20.48,24.29 23.65,27.46 23.65,29.21 24.77,30.32 JP2.12 | FLASH.5 21.67,33.73 v20.95,33.02
  Bottom 0.254: v20.95,33.02 23.5,30.48 JP2.12
X0D12
  Top 0.254: JP2.11 19.68,22.86 18.86,22.86 U$5.1
X0D13
  Top 0.254: U$5.48 21.08,21.72 JP2.10
X0D14
  Top 0.254: JP2.9 20.95,19.05 20.16,19.05 18.89,20.32 18.22,20.32 U$5.46
X0D15
  Top 0.254: JP2.8 22.86,20.32 20.95,18.41 20.16,18.41 18.89,19.68 18.15,19.68 U$5.45
X0D16
  Top 0.254: JP2.7 20.16,17.78 18.73,19.21 17.92,19.21 U$5.44
X0D17
  Top 0.254: JP2.6 22.86,15.24 21.11,16.99 20.32,16.99 18.57,18.73 17.69,18.73 U$5.43
X0D18
  Top 0.254: JP2.5 20.95,16.51 20.16,16.51 18.41,18.26 17.46,18.26 U$5.42
X0D19
  Top 0.254: JP2.4 24.77,10.79 23.5,12.06 23.5,13.34 20.8,16.03 20,16.03 18.26,17.78 17.23,17.78 U$5.41
X0D20
  Top 0.254: JP2.3 23.5,8.89 23.5,11.43 21.11,13.81 19.78,13.81 U$5.39
X0D21
  Top 0.254: JP2.2 22.86,6.99 22.86,11.43 20.95,13.34 19.55,13.34 U$5.38
X0D22
  Top 0.152: U$5.37 14.02,17.83 11.27,15.08 11.27,14.61 11.47,14.4 U$2.20
  Top 0.254: JP2.1 24.13,2.54 22.23,4.45 22.23,11.43 20.8,12.86 19.32,12.86 U$5.37
X0D23
  Top 0.152: 10.47,15.72 10.79,15.39 10.79,14.29 11.18,13.9 U$2.21 | JP1.14 3.17,11.43 3.17,13.97 5.4,16.19 7.94,16.19 8.41,15.72 10.47,15.72 | 10.47,15.72 10.84,15.72 12.19,17.07 12.19,17.44 U$5.36
X0D24
  Top 0.152: JP1.13 1.91,13.34 5.08,16.51 8.1,16.51 8.57,16.03 10.39,16.03 11.66,17.3 11.66,17.62 U$5.35
X0D25
  Top 0.152: JP1.12 3.49,16.83 8.26,16.83 8.73,16.35 10.24,16.35 11.19,17.3 11.19,17.85 U$5.34
X0D34
  Top 0.152: JP1.7 1.91,27.3 3.17,26.04 3.17,24.77 7.62,20.32 8.71,20.32 U$5.27
X0D35
  Top 0.152: JP1.6 1.91,29.84 3.81,27.94 3.81,24.77 7.62,20.95 8.64,20.95 U$5.26
X0D36
  Top 0.152: JP1.11 2.22,17.46 7.94,17.46 8.57,18.1 10.02,18.1 U$5.32
X0D37
  Top 0.152: JP1.10 2.22,20.32 4.76,17.78 7.62,17.78 8.26,18.41 9.63,18.41 U$5.31
X0D38
  Top 0.152: 9.8,20 U$5.29 9.49,19.68 6.35,19.68
  Top 0.254: JP1.9 3.17,22.86 6.35,19.68
X0D39
  Top 0.152: U$5.28 9.7,20.66 9.05,20 7.3,20 JP1.8
X0D52
  Top 0.152: 23.5,32.38 23.5,33.17 24.77,34.44 JP2.14
  Top 0.254: U$5.4 18.03,25.4 20.32,25.4 22.54,27.62 22.54,31.43 23.5,32.38
X0D53
  Top 0.152: 18.41,26.04 17.96,26.04 U$5.5 | 22.07,31.67 23.16,32.77 23.16,33.96 23.5,34.29
  Top 0.254: JP2.15 24.77,37.47 23.5,36.2 23.5,34.29 | 18.41,26.04 20.32,26.04 22.07,27.78 22.07,31.67
X0D54  (via drill 0.3 pad 0.81)
  Top 0.254: v17.94,26.67 17.78,26.56 U$5.6
  Bottom 0.254: JP2.16 19.05,37.47 17.78,36.2 17.78,33.66 19.68,31.75 19.68,28.57 17.94,26.83 v17.94,26.67
X0D55  (via drill 0.3 pad 0.81)
  Top 0.254: v13.81,26.19 13.97,26.29 U$5.11
  Bottom 0.254: v13.81,26.19 13.81,26.51 16.51,29.21 16.51,31.11 10.16,37.47 10.16,42.55 9.53,43.18 JP1.1

### Text on the board
tNames: XS1-L4 | GND | USB | 3.3V | ext | 5V
tValues: 1
bValues: XStick V1.0